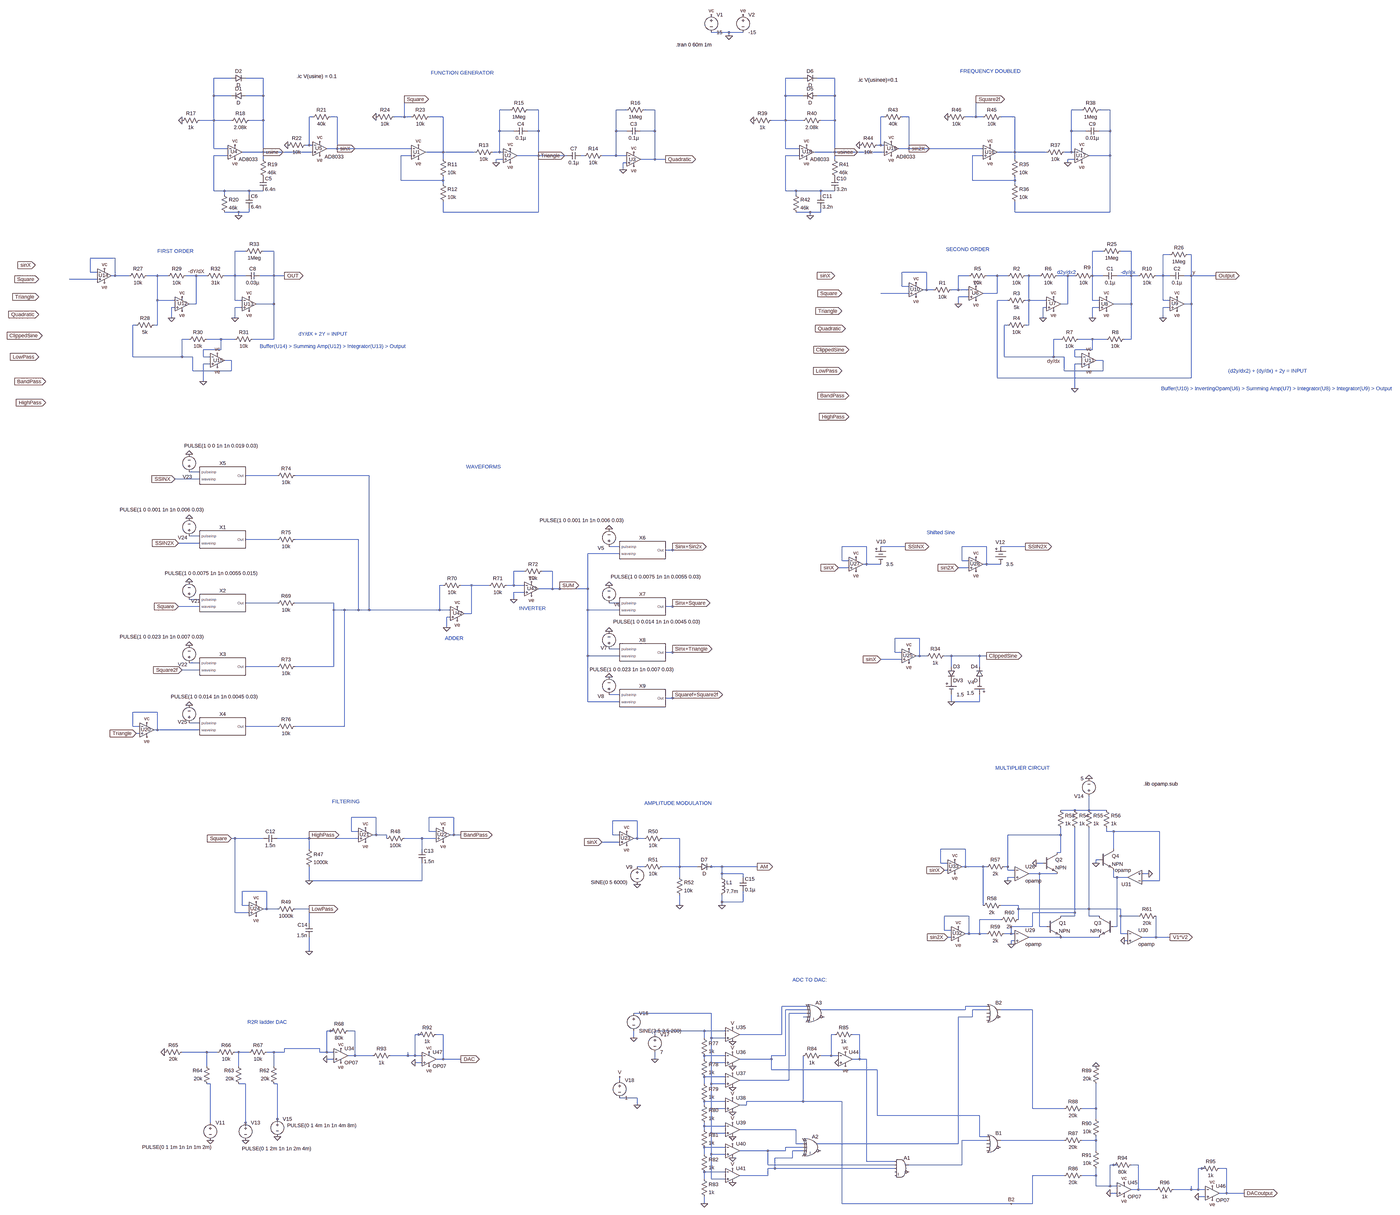
[diagram p0: schematic Main_circuit .asc, whole sheet]
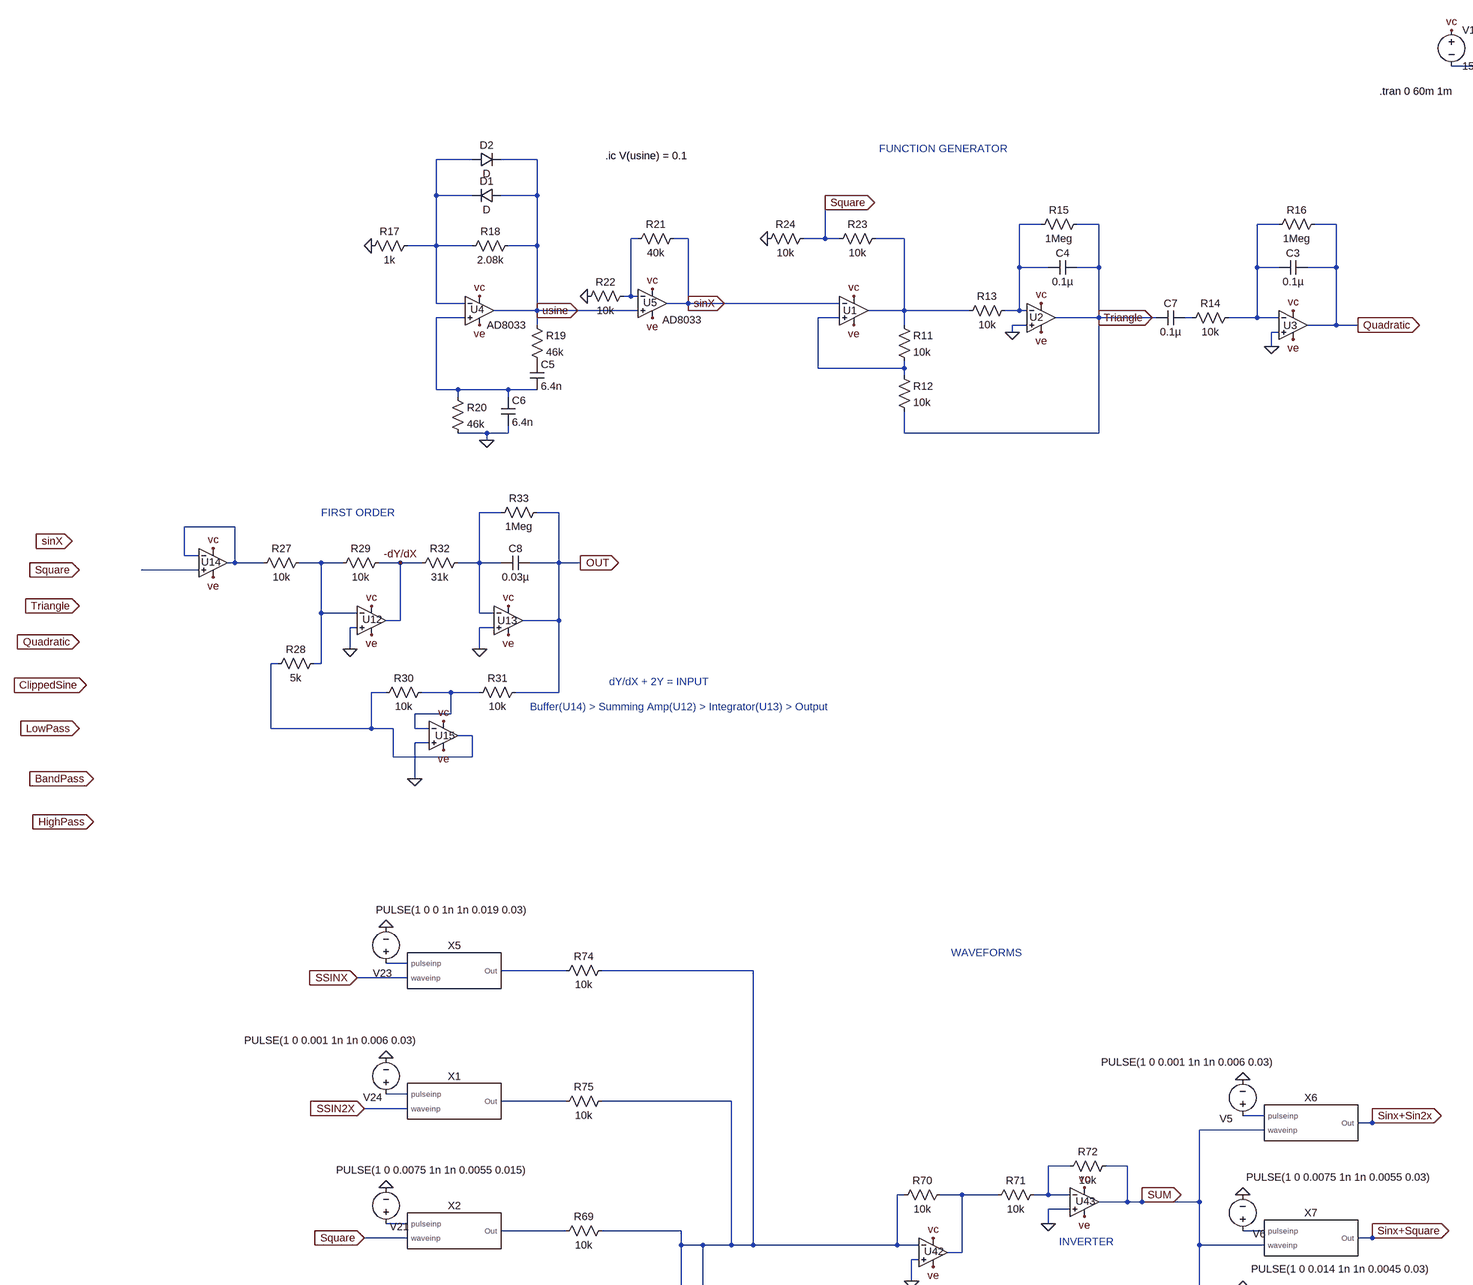
[diagram p1: schematic Main_circuit .asc, part, row 1 of 2, column 1 of 2]
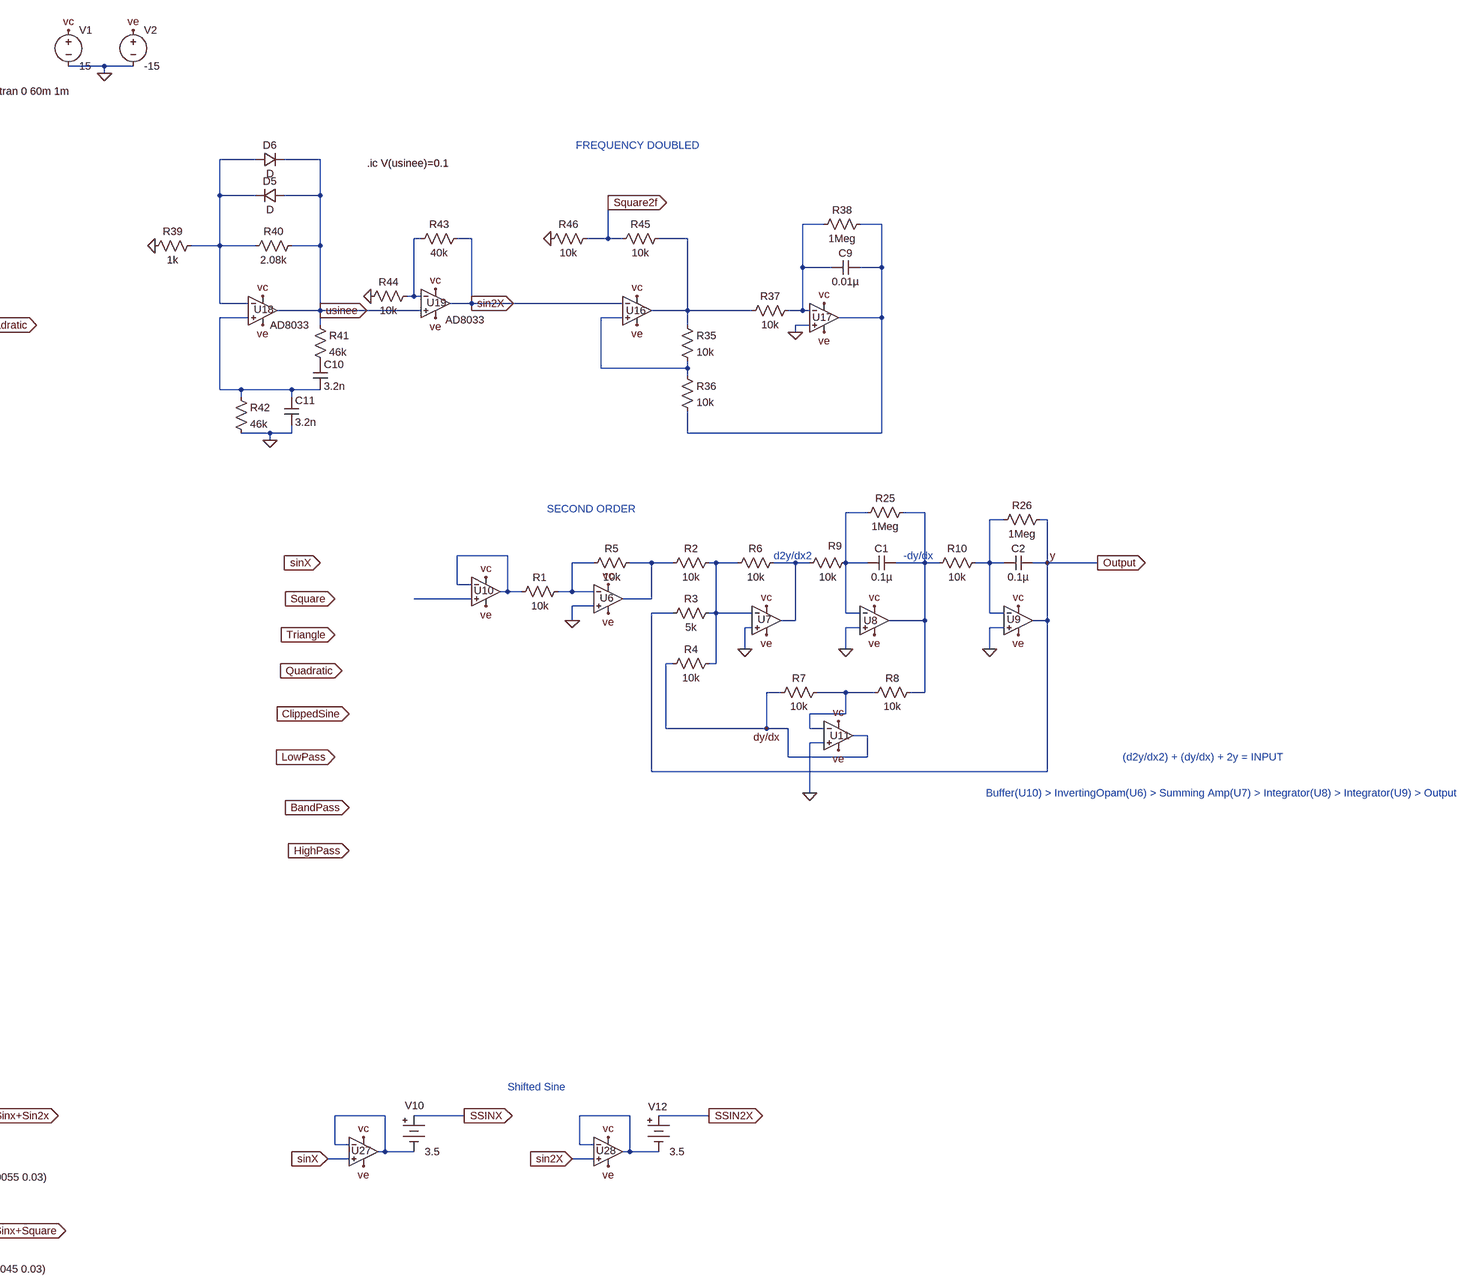
[diagram p2: schematic Main_circuit .asc, part, row 1 of 2, column 2 of 2]
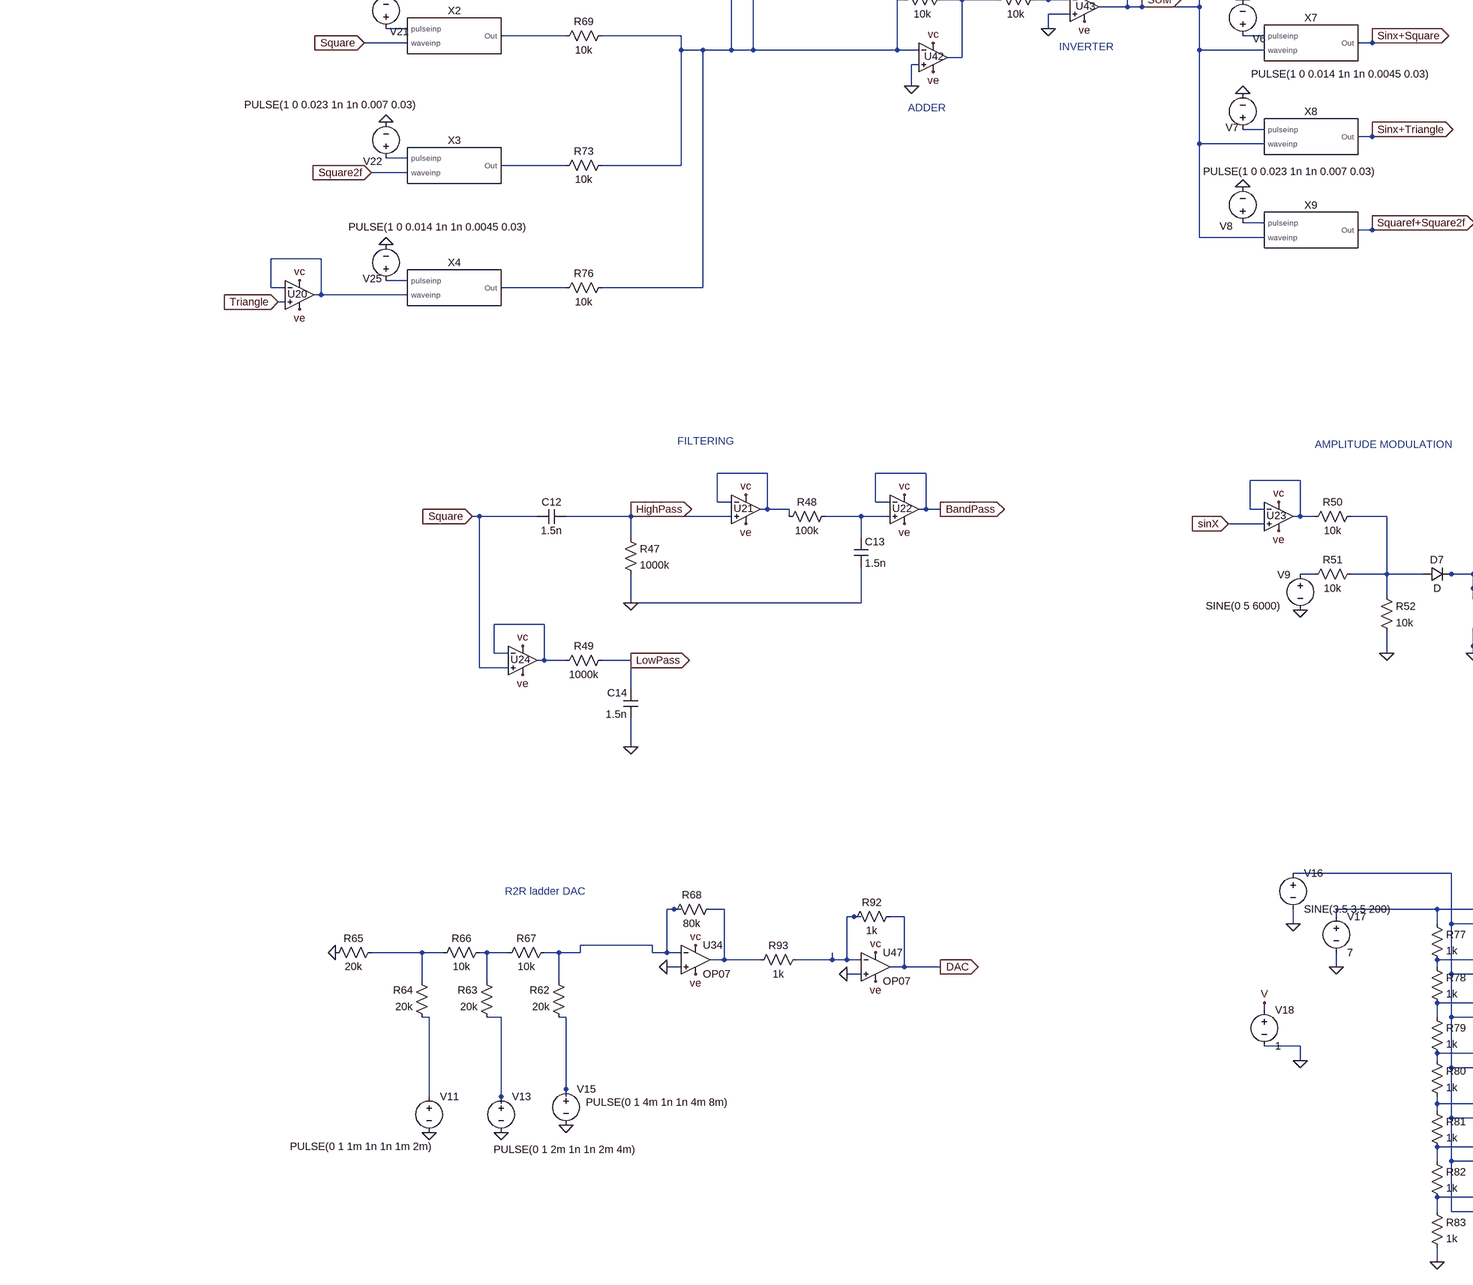
[diagram p3: schematic Main_circuit .asc, part, row 2 of 2, column 1 of 2]
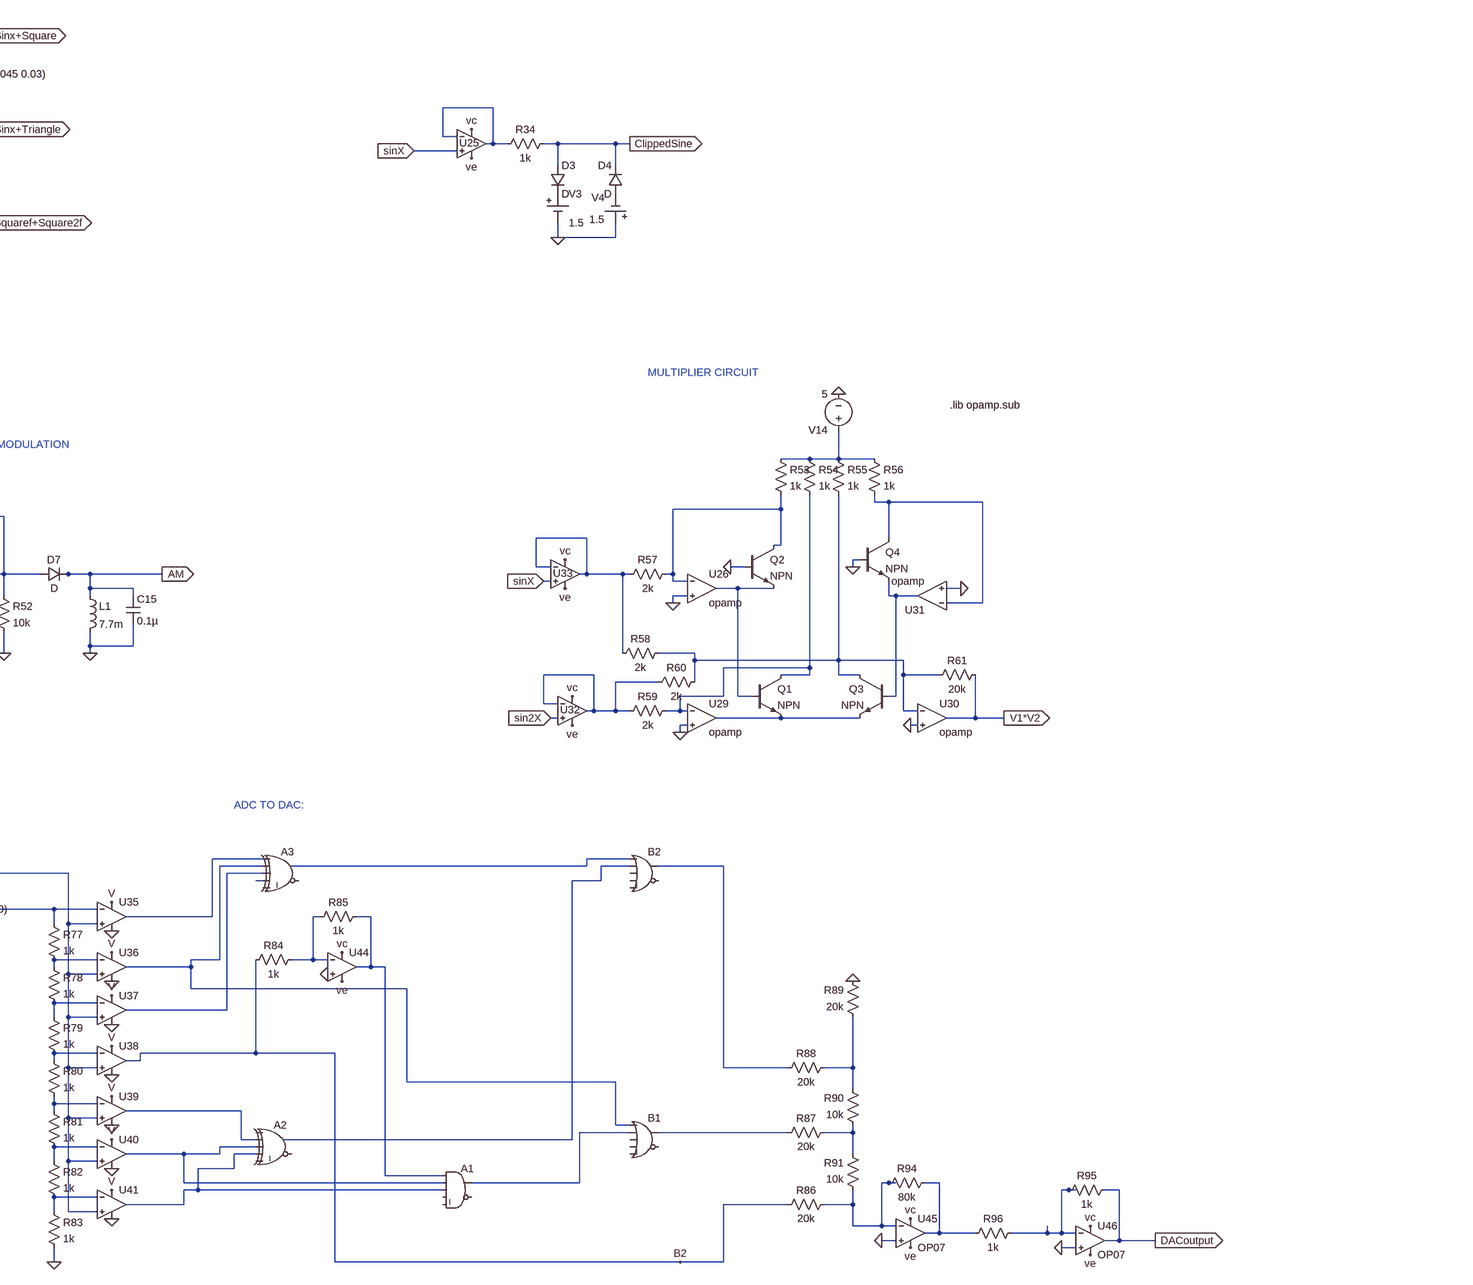
[diagram p4: schematic Main_circuit .asc, part, row 2 of 2, column 2 of 2]
* Main_circuit .asc
R1 N021 N023 10k
R2 N024 N025 10k
R3 y N025 5k
R4 dy/dx N025 10k
R5 N023 N024 10k
R6 N025 N026 10k
R7 dy/dx N031 10k
R8 N031 N018 10k
R9 N026 N017 10k
C1 N017 N018 0.1µ
R10 N018 N019 10k
C2 N019 y 0.1µ
X§U1 N012 sinX vc ve N008 level2 Avol=1Meg GBW=10Meg Slew=10Meg Ilimit=25m Rail=0 Vos=0 En=0 Enk=0 In=0 Ink=0 Rin=500Meg  ; pins In+ In- V+ V- OUT
X§U2 0 N003 vc ve Triangle level2 Avol=1Meg GBW=10Meg Slew=10Meg Ilimit=25m Rail=0 Vos=0 En=0 Enk=0 In=0 Ink=0 Rin=500Meg  ; pins In+ In- V+ V- OUT
R11 N008 N012 10k
R12 N012 Triangle 10k
R13 N003 N008 10k
R14 N004 N013 10k
X§U3 0 N004 vc ve Quadratic level2 Avol=1Meg GBW=10Meg Slew=10Meg Ilimit=25m Rail=0 Vos=0 En=0 Enk=0 In=0 Ink=0 Rin=500Meg  ; pins In+ In- V+ V- OUT
C3 Quadratic N004 0.1µ
C4 Triangle N003 0.1µ
V1 vc 0 15
V2 ve 0 -15
R15 Triangle N003 1Meg
R16 Quadratic N004 1Meg
R17 N001 0 1k
R18 usine N001 2.08k
C5 P001 N011 6.4n
R19 usine P001 46k
R20 N011 0 46k
C6 N011 0 6.4n
D1 usine N001 D
D2 N001 usine D
X§U4 N011 N001 vc ve usine AD8033  ; pins In+ In- V+ V- OUT
C7 N013 Triangle 0.1µ
X§U5 usine N007 vc ve sinX AD8033  ; pins In+ In- V+ V- OUT
R21 sinX N007 40k
R22 N007 0 10k
R23 N008 Square 10k
R24 Square 0 10k
R25 N018 N017 1Meg
R26 y N019 1Meg
X§U6 0 N023 vc ve N024 level2 Avol=1Meg GBW=10Meg Slew=10Meg Ilimit=25m Rail=0 Vos=0 En=0 Enk=0 In=0 Ink=0 Rin=500Meg  ; pins In+ In- V+ V- OUT
X§U7 0 N025 vc ve N026 level2 Avol=1Meg GBW=10Meg Slew=10Meg Ilimit=25m Rail=0 Vos=0 En=0 Enk=0 In=0 Ink=0 Rin=500Meg  ; pins In+ In- V+ V- OUT
X§U8 0 N017 vc ve N018 level2 Avol=1Meg GBW=10Meg Slew=10Meg Ilimit=25m Rail=0 Vos=0 En=0 Enk=0 In=0 Ink=0 Rin=500Meg  ; pins In+ In- V+ V- OUT
X§U9 0 N019 vc ve y level2 Avol=1Meg GBW=10Meg Slew=10Meg Ilimit=25m Rail=0 Vos=0 En=0 Enk=0 In=0 Ink=0 Rin=500Meg  ; pins In+ In- V+ V- OUT
X§U10 N028 N021 vc ve N021 level2 Avol=1Meg GBW=10Meg Slew=10Meg Ilimit=25m Rail=0 Vos=0 En=0 Enk=0 In=0 Ink=0 Rin=500Meg  ; pins In+ In- V+ V- OUT
X§U11 0 N031 vc ve dy/dx level2 Avol=1Meg GBW=10Meg Slew=10Meg Ilimit=25m Rail=0 Vos=0 En=0 Enk=0 In=0 Ink=0 Rin=500Meg  ; pins In+ In- V+ V- OUT
R27 N020 N022 10k
R28 N029 N022 5k
R29 N022 -dY/dX 10k
R30 N029 N030 10k
R31 N030 OUT 10k
R32 -dY/dX N016 31k
C8 N016 OUT 0.03µ
R33 OUT N016 1Meg
X§U12 0 N022 vc ve -dY/dX level2 Avol=1Meg GBW=10Meg Slew=10Meg Ilimit=25m Rail=0 Vos=0 En=0 Enk=0 In=0 Ink=0 Rin=500Meg  ; pins In+ In- V+ V- OUT
X§U13 0 N016 vc ve OUT level2 Avol=1Meg GBW=10Meg Slew=10Meg Ilimit=25m Rail=0 Vos=0 En=0 Enk=0 In=0 Ink=0 Rin=500Meg  ; pins In+ In- V+ V- OUT
X§U14 N027 N020 vc ve N020 level2 Avol=1Meg GBW=10Meg Slew=10Meg Ilimit=25m Rail=0 Vos=0 En=0 Enk=0 In=0 Ink=0 Rin=500Meg  ; pins In+ In- V+ V- OUT
X§U15 0 N030 vc ve N029 level2 Avol=1Meg GBW=10Meg Slew=10Meg Ilimit=25m Rail=0 Vos=0 En=0 Enk=0 In=0 Ink=0 Rin=500Meg  ; pins In+ In- V+ V- OUT
R34 ClippedSine N045 1k
D3 ClippedSine P002 D
V3 P002 0 1.5
D4 P003 ClippedSine D
V4 0 P003 1.5
X§U16 N015 sin2X vc ve N010 level2 Avol=1Meg GBW=10Meg Slew=10Meg Ilimit=25m Rail=0 Vos=0 En=0 Enk=0 In=0 Ink=0 Rin=500Meg  ; pins In+ In- V+ V- OUT
X§U17 0 N005 vc ve N006 level2 Avol=1Meg GBW=10Meg Slew=10Meg Ilimit=25m Rail=0 Vos=0 En=0 Enk=0 In=0 Ink=0 Rin=500Meg  ; pins In+ In- V+ V- OUT
R35 N010 N015 10k
R36 N015 N006 10k
R37 N005 N010 10k
C9 N006 N005 0.01µ
R38 N006 N005 1Meg
R39 N002 0 1k
R40 usinee N002 2.08k
C10 P004 N014 3.2n
R41 usinee P004 46k
R42 N014 0 46k
C11 N014 0 3.2n
D5 usinee N002 D
D6 N002 usinee D
X§U18 N014 N002 vc ve usinee AD8033  ; pins In+ In- V+ V- OUT
X§U19 usinee N009 vc ve sin2X AD8033  ; pins In+ In- V+ V- OUT
R43 sin2X N009 40k
R44 N009 0 10k
R45 N010 Square2f 10k
R46 Square2f 0 10k
R69 N043 N034 10k
R70 N034 N041 10k
X§U42 0 N034 vc ve N041 level2 Avol=1Meg GBW=10Meg Slew=10Meg Ilimit=25m Rail=0 Vos=0 En=0 Enk=0 In=0 Ink=0 Rin=500Meg  ; pins In+ In- V+ V- OUT
R71 N041 N040 10k
R72 N040 SUM 10k
X§U43 0 N040 vc ve SUM level2 Avol=1Meg GBW=10Meg Slew=10Meg Ilimit=25m Rail=0 Vos=0 En=0 Enk=0 In=0 Ink=0 Rin=500Meg  ; pins In+ In- V+ V- OUT
R73 N034 N048 10k
V21 N042 0 PULSE(1 0 0.0075 1n 1n 0.0055 0.015)
V22 N047 0 PULSE(1 0 0.023 1n 1n 0.007 0.03)
V23 N032 0 PULSE(1 0 0 1n 1n 0.019 0.03)
R74 N033 N034 10k
V24 N035 0 PULSE(1 0 0.001 1n 1n 0.006 0.03)
R75 N034 N036 10k
V25 N051 0 PULSE(1 0 0.014 1n 1n 0.0045 0.03)
R76 N034 N052 10k
X§X1 N035 SSIN2X N036 Draft23symbiol  ; pins pulseinp waveinp Out
X§X2 N042 Square N043 Draft23symbiol  ; pins pulseinp waveinp Out
X§X3 N047 Square2f N048 Draft23symbiol  ; pins pulseinp waveinp Out
X§X4 N051 N050 N052 Draft23symbiol  ; pins pulseinp waveinp Out
X§X5 N032 SSINX N033 Draft23symbiol  ; pins pulseinp waveinp Out
X§U20 Triangle N050 vc ve N050 level2 Avol=1Meg GBW=10Meg Slew=10Meg Ilimit=25m Rail=0 Vos=0 En=0 Enk=0 In=0 Ink=0 Rin=500Meg  ; pins In+ In- V+ V- OUT
V5 N037 0 PULSE(1 0 0.001 1n 1n 0.006 0.03)
X§X6 N037 SUM Sinx+Sin2x Draft23symbiol  ; pins pulseinp waveinp Out
V6 N044 0 PULSE(1 0 0.0075 1n 1n 0.0055 0.03)
X§X7 N044 SUM Sinx+Square Draft23symbiol  ; pins pulseinp waveinp Out
V7 N046 0 PULSE(1 0 0.014 1n 1n 0.0045 0.03)
X§X8 N046 SUM Sinx+Triangle Draft23symbiol  ; pins pulseinp waveinp Out
V8 N049 0 PULSE(1 0 0.023 1n 1n 0.007 0.03)
X§X9 N049 SUM Squaref+Square2f Draft23symbiol  ; pins pulseinp waveinp Out
R47 HighPass 0 1000k
X§U21 HighPass N054 vc ve N054 level2 Avol=1Meg GBW=10Meg Slew=10Meg Ilimit=25m Rail=0 Vos=0 En=0 Enk=0 In=0 Ink=0 Rin=500Meg  ; pins In+ In- V+ V- OUT
R48 N058 N054 100k
C13 N058 0 1.5n
X§U22 N058 BandPass vc ve BandPass level2 Avol=1Meg GBW=10Meg Slew=10Meg Ilimit=25m Rail=0 Vos=0 En=0 Enk=0 In=0 Ink=0 Rin=500Meg  ; pins In+ In- V+ V- OUT
C14 0 LowPass 1.5n
R49 LowPass N064 1000k
X§U24 Square N064 vc ve N064 level2 Avol=1Meg GBW=10Meg Slew=10Meg Ilimit=25m Rail=0 Vos=0 En=0 Enk=0 In=0 Ink=0 Rin=500Meg  ; pins In+ In- V+ V- OUT
X§U25 sinX N045 vc ve N045 level2 Avol=1Meg GBW=10Meg Slew=10Meg Ilimit=25m Rail=0 Vos=0 En=0 Enk=0 In=0 Ink=0 Rin=500Meg  ; pins In+ In- V+ V- OUT
R50 N059 N055 10k
R51 N059 N061 10k
R52 N059 0 10k
D7 N059 AM D
L1 AM 0 7.7m
C15 AM 0 0.1µ
V9 N061 0 SINE(0 5 6000)
X§U27 sinX N038 vc ve N038 level2 Avol=1Meg GBW=10Meg Slew=10Meg Ilimit=25m Rail=0 Vos=0 En=0 Enk=0 In=0 Ink=0 Rin=500Meg  ; pins In+ In- V+ V- OUT
X§U28 sin2X N039 vc ve N039 level2 Avol=1Meg GBW=10Meg Slew=10Meg Ilimit=25m Rail=0 Vos=0 En=0 Enk=0 In=0 Ink=0 Rin=500Meg  ; pins In+ In- V+ V- OUT
X§U23 sinX N055 vc ve N055 level2 Avol=1Meg GBW=10Meg Slew=10Meg Ilimit=25m Rail=0 Vos=0 En=0 Enk=0 In=0 Ink=0 Rin=500Meg  ; pins In+ In- V+ V- OUT
V12 SSIN2X N039 3.5
V10 SSINX N038 3.5
Q1 N066 N062 N068 0 NPN
Q2 N057 0 N062 0 NPN
Q3 N065 N063 N068 0 NPN
R53 N053 N057 1k
R54 N053 N066 1k
R55 N053 N065 1k
R56 N053 N056 1k
R57 N057 N060 2k
R58 N065 N060 2k
R59 N066 N067 2k
R60 N065 N067 2k
R61 V1*V2 N065 20k
Q4 N056 0 N063 0 NPN
V14 N053 0 5
X§U26 N057 0 N062 opamp Aol=100K GBW=10Meg  ; pins invin noninvin out
X§U29 N066 0 N068 opamp Aol=100K GBW=10Meg  ; pins invin noninvin out
X§U30 N065 0 V1*V2 opamp Aol=100K GBW=10Meg  ; pins invin noninvin out
X§U31 N056 0 N063 opamp Aol=100K GBW=10Meg  ; pins invin noninvin out
X§U32 sin2X N067 vc ve N067 level2 Avol=1Meg GBW=10Meg Slew=10Meg Ilimit=25m Rail=0 Vos=0 En=0 Enk=0 In=0 Ink=0 Rin=500Meg  ; pins In+ In- V+ V- OUT
C12 HighPass Square 1.5n
X§U33 sinX N060 vc ve N060 level2 Avol=1Meg GBW=10Meg Slew=10Meg Ilimit=25m Rail=0 Vos=0 En=0 Enk=0 In=0 Ink=0 Rin=500Meg  ; pins In+ In- V+ V- OUT
R62 N089 N077 20k
R63 N088 N084 20k
R64 N087 N083 20k
R65 N083 0 20k
R66 N084 N083 10k
R67 N077 N084 10k
X§U34 0 N077 vc ve N078 LT1001  ; OP07, pins In+ In- V+ V- OUT
R68 N078 N077 80k
V11 N087 0 PULSE(0 1 1m 1n 1n 1m 2m)
V13 N088 0 PULSE(0 1 2m 1n 1n 2m 4m)
V15 N089 0 PULSE(0 1 4m 1n 1n 4m 8m)
X§U35 N074 N079 V 0 N069 level.2 Avol=1Meg GBW=10Meg Slew=10Meg ilimit=25m rail=0 Vos=0 phimargin=45 en=0 enk=0 in=0 ink=0 Rin=500Meg  ; pins IN+ IN- V+ V- OUT
X§U36 N074 N085 V 0 N071 level.2 Avol=1Meg GBW=10Meg Slew=10Meg ilimit=25m rail=0 Vos=0 phimargin=45 en=0 enk=0 in=0 ink=0 Rin=500Meg  ; pins IN+ IN- V+ V- OUT
X§U37 N074 N086 V 0 N075 level.2 Avol=1Meg GBW=10Meg Slew=10Meg ilimit=25m rail=0 Vos=0 phimargin=45 en=0 enk=0 in=0 ink=0 Rin=500Meg  ; pins IN+ IN- V+ V- OUT
X§U38 N074 N090 V 0 B2 level.2 Avol=1Meg GBW=10Meg Slew=10Meg ilimit=25m rail=0 Vos=0 phimargin=45 en=0 enk=0 in=0 ink=0 Rin=500Meg  ; pins IN+ IN- V+ V- OUT
X§U39 N074 N092 V 0 N093 level.2 Avol=1Meg GBW=10Meg Slew=10Meg ilimit=25m rail=0 Vos=0 phimargin=45 en=0 enk=0 in=0 ink=0 Rin=500Meg  ; pins IN+ IN- V+ V- OUT
X§U40 N074 N097 V 0 N098 level.2 Avol=1Meg GBW=10Meg Slew=10Meg ilimit=25m rail=0 Vos=0 phimargin=45 en=0 enk=0 in=0 ink=0 Rin=500Meg  ; pins IN+ IN- V+ V- OUT
X§U41 N074 N103 V 0 N099 level.2 Avol=1Meg GBW=10Meg Slew=10Meg ilimit=25m rail=0 Vos=0 phimargin=45 en=0 enk=0 in=0 ink=0 Rin=500Meg  ; pins IN+ IN- V+ V- OUT
V16 N074 0 SINE(3.5 3.5 200)
V17 N079 0 7
V18 V 0 1
R77 N079 N085 1k
R78 N085 N086 1k
R79 N086 N090 1k
R80 N090 N092 1k
R81 N092 N097 1k
R82 N097 N103 1k
R83 N103 0 1k
X§U44 0 N081 vc ve N082 level.2 Avol=1Meg GBW=10Meg Slew=10Meg ilimit=25m rail=0 Vos=0 phimargin=45 en=0 enk=0 in=0 ink=0 Rin=500Meg  ; pins IN+ IN- V+ V- OUT
R84 N081 B2 1k
R85 N082 N081 1k
A1 N082 N098 N099 0 0 0 N094 0 AND
A2 0 N093 N098 N099 0 0 N072 0 XOR
A3 N069 N071 N075 N076 0 0 N070 0 XOR
A§B1 N071 N094 0 0 0 0 N095 0 OR
A§B2 N070 N072 0 0 0 0 N073 0 OR
X§U47 0 N080 vc ve DAC LT1001  ; OP07, pins In+ In- V+ V- OUT
R92 DAC N080 1k
R93 N080 N078 1k
R86 B2 N100 20k
R87 N095 N096 20k
R88 N073 N091 20k
R89 N091 0 20k
R90 N096 N091 10k
R91 N100 N096 10k
X§U45 0 N100 vc ve N101 LT1001  ; OP07, pins In+ In- V+ V- OUT
R94 N101 N100 80k
X§U46 0 N102 vc ve DACoutput LT1001  ; OP07, pins In+ In- V+ V- OUT
R95 DACoutput N102 1k
R96 N102 N101 1k
.model D D
.lib standard.dio
.model NPN NPN
.model PNP PNP
.lib standard.bjt
.tran 0 60m 1m
.ic V(usine) = 0.1
* (d2y/dx2) + (dy/dx) + 2y = INPUT
* Buffer(U10) > InvertingOpam(U6) > Summing Amp(U7) > Integrator(U8) > Integrator(U9) > Output
* dY/dX + 2Y = INPUT
* Buffer(U14) > Summing Amp(U12) > Integrator(U13) > Output
.ic V(usinee)=0.1
* FREQUENCY DOUBLED
* Shifted Sine
* FILTERING
* AMPLITUDE MODULATION
.lib opamp.sub
* MULTIPLIER CIRCUIT
* FIRST ORDER
* SECOND ORDER
* WAVEFORMS
* FUNCTION GENERATOR
* -dy/dx
* d2y/dx2
* ADDER
* INVERTER
* ADC TO DAC:
* R2R ladder DAC
.lib UniversalOpAmp2.lib
.lib LTC.lib
.lib UniversalOpamps2.sub
.backanno
.end